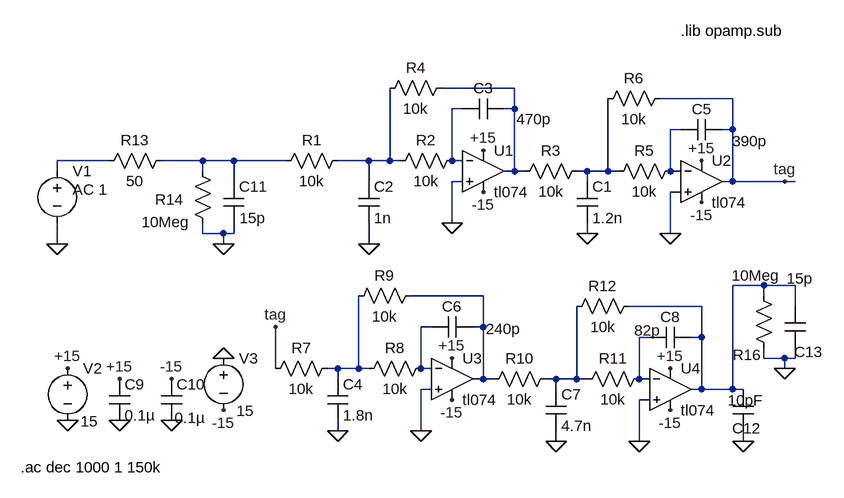
[diagram p0: schematic filtro modelo ruidol.asc]
filtro modelo ruidol.asc, the LTspice schematic file:
Version 4
SHEET 1 1620 680
WIRE 0 -432 -112 -432
WIRE 336 -416 224 -416
WIRE -80 -400 -96 -400
WIRE 0 -400 0 -432
WIRE 0 -400 -16 -400
WIRE 256 -368 240 -368
WIRE 336 -368 336 -416
WIRE 336 -368 320 -368
WIRE -624 -320 -704 -320
WIRE -480 -320 -544 -320
WIRE -432 -320 -480 -320
WIRE -352 -320 -432 -320
WIRE -224 -320 -272 -320
WIRE -192 -320 -192 -432
WIRE -192 -320 -224 -320
WIRE -176 -320 -192 -320
WIRE -96 -320 -96 -400
WIRE -80 -320 -96 -320
WIRE -704 -304 -704 -320
WIRE -480 -304 -480 -320
WIRE 0 -304 0 -400
WIRE 0 -304 -16 -304
WIRE 16 -304 0 -304
WIRE 112 -304 96 -304
WIRE 144 -304 144 -416
WIRE 144 -304 112 -304
WIRE 160 -304 144 -304
WIRE 240 -304 240 -368
WIRE 256 -304 240 -304
WIRE -432 -288 -432 -320
WIRE -224 -288 -224 -320
WIRE -80 -288 -96 -288
WIRE 112 -288 112 -304
WIRE 336 -288 336 -368
WIRE 336 -288 320 -288
WIRE 416 -288 336 -288
WIRE 432 -288 416 -288
WIRE 256 -272 240 -272
WIRE -96 -224 -96 -288
WIRE -480 -208 -480 -224
WIRE -448 -208 -480 -208
WIRE -432 -208 -432 -224
WIRE -432 -208 -448 -208
WIRE 112 -208 112 -224
WIRE 240 -208 240 -272
WIRE -704 -192 -704 -224
WIRE -448 -192 -448 -208
WIRE -224 -192 -224 -224
WIRE 384 -128 336 -128
WIRE 432 -128 384 -128
WIRE -48 -112 -160 -112
WIRE 384 -112 384 -128
WIRE 288 -96 176 -96
WIRE 432 -96 432 -128
WIRE -128 -64 -144 -64
WIRE -48 -64 -48 -112
WIRE -48 -64 -64 -64
WIRE 208 -48 192 -48
WIRE 288 -48 288 -96
WIRE 288 -48 272 -48
WIRE 384 -16 384 -32
WIRE 416 -16 384 -16
WIRE 432 -16 432 -32
WIRE 432 -16 416 -16
WIRE -368 0 -368 -64
WIRE -272 0 -288 0
WIRE -240 0 -240 -112
WIRE -240 0 -272 0
WIRE -224 0 -240 0
WIRE -144 0 -144 -64
WIRE -128 0 -144 0
WIRE 416 0 416 -16
WIRE -272 16 -272 0
WIRE -48 16 -48 -64
WIRE -48 16 -64 16
WIRE -32 16 -48 16
WIRE 64 16 48 16
WIRE 96 16 96 -96
WIRE 96 16 64 16
WIRE 112 16 96 16
WIRE 192 16 192 -48
WIRE 208 16 192 16
WIRE -128 32 -144 32
WIRE 64 32 64 16
WIRE 288 32 288 -48
WIRE 288 32 272 32
WIRE 336 32 336 -128
WIRE 336 32 288 32
WIRE 352 32 336 32
WIRE 208 48 192 48
WIRE -272 96 -272 80
WIRE -144 96 -144 32
WIRE 64 112 64 96
WIRE 192 112 192 48
WIRE 352 112 352 96
FLAG 112 -208 0
FLAG -96 -224 0
FLAG -224 -192 0
FLAG 240 -208 0
FLAG -272 96 0
FLAG -144 96 0
FLAG 64 112 0
FLAG 192 112 0
FLAG 416 -288 tag
FLAG -368 -64 tag
FLAG -688 0 +15
FLAG -48 -336 +15
FLAG 288 -320 +15
FLAG 240 0 +15
FLAG -96 -16 +15
FLAG -448 64 -15
FLAG -48 -272 -15
FLAG -96 48 -15
FLAG 240 64 -15
FLAG 288 -256 -15
FLAG -704 -192 0
FLAG -528 80 0
FLAG -448 -192 0
FLAG -608 80 0
FLAG -688 80 0
FLAG -448 -16 0
FLAG -608 16 +15
FLAG -528 16 -15
FLAG 352 112 0
FLAG 416 0 0
SYMBOL res 112 -320 R90
WINDOW 0 0 56 VBottom 2
WINDOW 3 32 56 VTop 2
SYMATTR InstName R3
SYMATTR Value 10k
SYMBOL cap 96 -288 R0
SYMATTR InstName C1
SYMATTR Value 1.2n
SYMBOL res -368 -304 R270
WINDOW 0 32 56 VTop 2
WINDOW 3 0 56 VBottom 2
SYMATTR InstName R1
SYMATTR Value 10k
SYMBOL cap -240 -288 R0
SYMATTR InstName C2
SYMATTR Value 1n
SYMBOL res -192 -304 R270
WINDOW 0 32 56 VTop 2
WINDOW 3 0 56 VBottom 2
SYMATTR InstName R2
SYMATTR Value 10k
SYMBOL res -208 -416 R270
WINDOW 0 32 56 VTop 2
WINDOW 3 0 56 VBottom 2
SYMATTR InstName R4
SYMATTR Value 10k
SYMBOL cap -80 -384 R270
WINDOW 0 32 32 VTop 2
WINDOW 3 16 110 VBottom 2
SYMATTR InstName C3
SYMATTR Value 470p
SYMBOL res 144 -288 R270
WINDOW 0 32 56 VTop 2
WINDOW 3 0 56 VBottom 2
SYMATTR InstName R5
SYMATTR Value 10k
SYMBOL res 128 -400 R270
WINDOW 0 32 56 VTop 2
WINDOW 3 0 56 VBottom 2
SYMATTR InstName R6
SYMATTR Value 10k
SYMBOL cap 256 -352 R270
WINDOW 0 32 32 VTop 2
WINDOW 3 14 106 VBottom 2
SYMATTR InstName C5
SYMATTR Value 390p
SYMBOL res -272 -16 R90
WINDOW 0 0 56 VBottom 2
WINDOW 3 32 56 VTop 2
SYMATTR InstName R7
SYMATTR Value 10k
SYMBOL cap -288 16 R0
SYMATTR InstName C4
SYMATTR Value 1.8n
SYMBOL res -240 16 R270
WINDOW 0 32 56 VTop 2
WINDOW 3 0 56 VBottom 2
SYMATTR InstName R8
SYMATTR Value 10k
SYMBOL res -256 -96 R270
WINDOW 0 32 56 VTop 2
WINDOW 3 0 56 VBottom 2
SYMATTR InstName R9
SYMATTR Value 10k
SYMBOL cap -128 -48 R270
WINDOW 0 32 32 VTop 2
WINDOW 3 29 111 VBottom 2
SYMATTR InstName C6
SYMATTR Value 240p
SYMBOL res 64 0 R90
WINDOW 0 0 56 VBottom 2
WINDOW 3 32 56 VTop 2
SYMATTR InstName R10
SYMATTR Value 10k
SYMBOL cap 48 32 R0
SYMATTR InstName C7
SYMATTR Value 4.7n
SYMBOL res 96 32 R270
WINDOW 0 32 56 VTop 2
WINDOW 3 0 56 VBottom 2
SYMATTR InstName R11
SYMATTR Value 10k
SYMBOL res 80 -80 R270
WINDOW 0 32 56 VTop 2
WINDOW 3 0 56 VBottom 2
SYMATTR InstName R12
SYMATTR Value 10k
SYMBOL cap 208 -32 R270
WINDOW 0 32 32 VTop 2
WINDOW 3 42 -3 VBottom 2
SYMATTR InstName C8
SYMATTR Value 82p
SYMBOL tl074\\tl074 -48 -368 R0
SYMATTR InstName U1
SYMBOL tl074\\tl074 288 -352 R0
SYMATTR InstName U2
SYMBOL tl074\\tl074 -96 -48 R0
SYMATTR InstName U3
SYMBOL tl074\\tl074 240 -32 R0
SYMATTR InstName U4
SYMBOL voltage -688 -16 R0
WINDOW 123 24 124 Left 2
WINDOW 39 24 152 Left 2
WINDOW 3 20 97 Left 2
SYMATTR Value 15
SYMATTR InstName V2
SYMBOL voltage -448 -32 R0
WINDOW 123 24 124 Left 2
WINDOW 39 24 152 Left 2
WINDOW 3 20 97 Left 2
SYMATTR Value 15
SYMATTR InstName V3
SYMBOL voltage -704 -320 R0
WINDOW 123 24 44 Left 2
WINDOW 39 0 0 Left 2
SYMATTR Value2 AC 1
SYMATTR InstName V1
SYMATTR Value ""
SYMBOL cap -624 16 R0
SYMATTR InstName C9
SYMATTR Value 0.1µ
SYMBOL cap -544 16 R0
WINDOW 3 21 60 Left 2
SYMATTR Value 0.1µ
SYMATTR InstName C10
SYMBOL res -528 -336 R90
WINDOW 0 0 56 VBottom 2
WINDOW 3 32 56 VTop 2
SYMATTR InstName R13
SYMATTR Value 50
SYMBOL res -464 -208 R180
WINDOW 0 45 52 Left 2
WINDOW 3 36 18 Left 2
SYMATTR InstName R14
SYMATTR Value 10Meg
SYMBOL cap -448 -288 R0
WINDOW 3 25 56 Left 2
SYMATTR Value 15p
SYMATTR InstName C11
SYMBOL cap 336 32 R0
WINDOW 0 -1 60 Left 2
WINDOW 3 -8 17 Left 2
SYMATTR InstName C12
SYMATTR Value 10pF
SYMBOL res 400 -16 R180
WINDOW 0 20 5 Left 2
WINDOW 3 -9 127 Left 2
SYMATTR InstName R16
SYMATTR Value 10Meg
SYMBOL cap 416 -96 R0
WINDOW 3 3 -43 Left 2
WINDOW 0 15 70 Left 2
SYMATTR Value 15p
SYMATTR InstName C13
TEXT 256 -520 Left 2 !.lib opamp.sub
TEXT -760 152 Left 2 !.ac dec 1000 1 150k

The netlist it stands for:
* filtro modelo ruidol.asc
R3 N007 N001 10k
C1 N007 0 1.2n
R1 N005 N006 10k
C2 N006 0 1n
R2 N006 N002 10k
R4 N006 N001 10k
C3 N002 N001 470p
R5 N007 N003 10k
R6 N007 tag 10k
C5 N003 tag 390p
R7 N012 tag 10k
C4 N012 0 1.8n
R8 N012 N010 10k
R9 N012 N009 10k
C6 N010 N009 240p
R10 N013 N009 10k
C7 N013 0 4.7n
R11 N013 N011 10k
R12 N013 N008 10k
C8 N011 N008 82p
* U1: tl074 (symbol tl074\tl074 not available, pins judged from their places): In+=0 In-=N002 V+=+15 V-=-15 OUT=N001
* U2: tl074 (symbol tl074\tl074 not available, pins judged from their places): In+=0 In-=N003 V+=+15 V-=-15 OUT=tag
* U3: tl074 (symbol tl074\tl074 not available, pins judged from their places): In+=0 In-=N010 V+=+15 V-=-15 OUT=N009
* U4: tl074 (symbol tl074\tl074 not available, pins judged from their places): In+=0 In-=N011 V+=+15 V-=-15 OUT=N008
V2 +15 0 15
V3 0 -15 15
V1 N004 0 AC 1
C9 +15 0 0.1µ
C10 -15 0 0.1µ
R13 N005 N004 50
R14 0 N005 10Meg
C11 N005 0 15p
C12 N008 0 10pF
R16 0 N008 10Meg
C13 N008 0 15p
.lib opamp.sub
.ac dec 1000 1 150k
.backanno
.end